# Altium schematic sheet POWER.SchDoc: POWER
size A; ApprovedBy: Abbas Mahmoud; CheckedBy: Abbas Mahmoud; Author: Abbas Mahmoud; CompanyName: lsa 4wya :); DrawnBy: Abbas Mahmoud; Engineer: Abbas Mahmoud; DocumentNumber: 3; Revision: 1; SheetNumber: 3; SheetTotal: 8
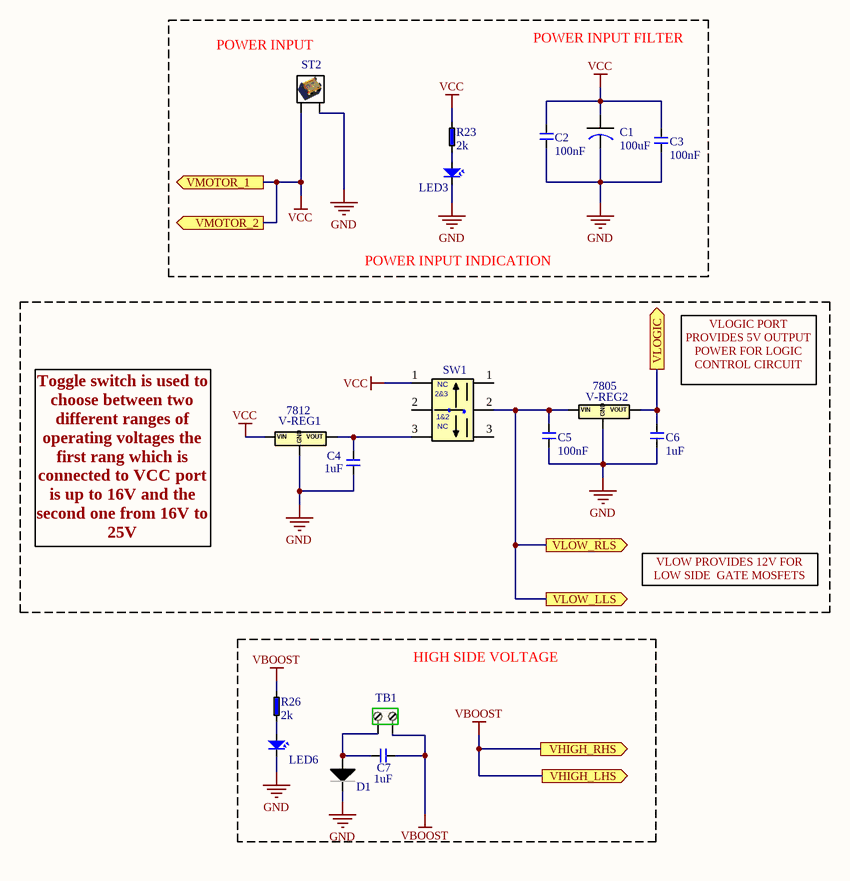
[diagram p0: POWER.SchDoc]

## Parts
C1  100uF  [ECAP 5X11X2MM]
C2  100nF  [CCAP 0.1 N Y]
C3  100nF  [CCAP 0.1 N Y]
C4  1uF  [CCAP 0.1 N Y]
C5  100nF  [CCAP 0.1 N Y]
C6  1uF  [CCAP 0.1 N Y]
C7  1uF  [CCAP 0.1 N Y]
D1  DIODE  [DIODE SMD]  (value not drawn)
LED3  LED  [LED 3MM GREEN]  (value not drawn)
LED6  LED  [LED 5MM GREEN]  (value not drawn)
R23  2k  [RESISTOR _9]
R26  2k  [RESISTOR _9]
ST2  SCREW TERMINAL  [SCREW TERMINAL]  (value not drawn)
SW1  Toggle Switch  [Toggle 3 pins]  (value not drawn)
TB1  Terminal block 2 pin  [AK500/2 - pluggable]  (value not drawn)
V-REG1  7812  [V-REG]
V-REG2  7805  [V-REG]

## Blocks framed on the sheet
HIGH SIDE VOLTAGE: C7 D1 LED6 R26 TB1

## Ports
VHIGH_LHS (out), VHIGH_RHS (out), VLOGIC (out), VLOW_LLS (out), VLOW_RLS (out), VMOTOR_1 (out), VMOTOR_2 (out)

## Nets
GND: C1.K C2.2 C3.2 C4.2 C5.2 C6.2 D1.K LED3.K LED6.K ST2.2(AC) V-REG1.2(GND) V-REG2.2(GND)
VBOOST: C7.2 R26.2 TB1.1 ; port VHIGH_RHS, port VHIGH_LHS
VCC: C1.A C2.1 C3.1 R23.2 ST2.1(AC) SW1.1 V-REG1.1(VIN) ; port VMOTOR_1, port VMOTOR_2
VLOGIC: C6.1 V-REG2.3(VOUT) ; port VLOGIC
VLOW_LLS: C5.1 SW1.2 V-REG2.1(VIN) ; port VLOW_RLS, port VLOW_LLS
NetC4_1: C4.1 SW1.3 V-REG1.3(VOUT)
NetC7_1: C7.1 D1.A TB1.2
NetLED3_A: LED3.A R23.1
NetLED6_A: LED6.A R26.1

## Notes on the sheet
- (near ST2) POWER INPUT
- POWER INPUT FILTER
- POWER INPUT INDICATION
- VLOGIC PORT PROVIDES 5V OUTPUT POWER FOR LOGIC CONTROL CIRCUIT
- Toggle switch is used to choose between two different ranges of operating voltages the first rang which is connected to VCC port is up to 16V and the second one from 16V to 25V
- VLOW PROVIDES 12V FOR LOW SIDE  GATE MOSFETS
- Title
- Size:
- Date:
- A
- Number:
- Time:
- Revision:
- Sheet
- of
- File:
- (in symbol Toggle Switch) NC; 2&3; 1&2

## Library data of the parts
C1 = CAP POL
C2-C7 = CERAMIC CAP
R23 R26 = RESISTOR
ST2 = SCREW TERMINAL: Barrier Terminal Block 2 Pin with cover 300V/25A
SW1 = Toggle Switch: Toggle Switch 3-Pin SPDT ON-ON 6A 125VAC
TB1 = Terminal block 2 pin: Terminal Block 2 Pin 10A 300V
V-REG1 V-REG2 = V-REG: 78xx Regulators